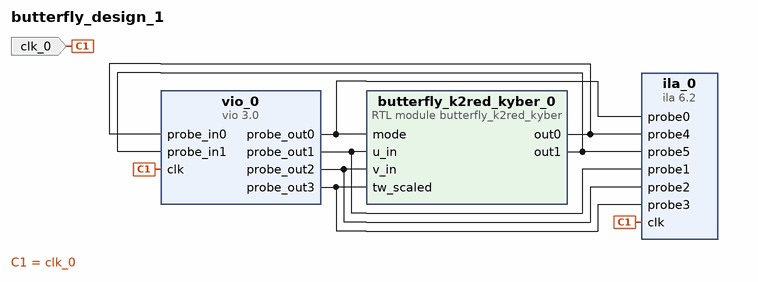
[diagram p0: block diagram of the top level]
# Vivado block design butterfly_design_1, xc7k70tfbv676-1, Vivado 2023.2
create_bd_design butterfly_design_1

create_bd_port -dir I -type clk clk_0

create_bd_cell -type module -reference butterfly_k2red_kyber butterfly_k2red_kyber_0
create_bd_cell -type ip -vlnv xilinx.com:ip:vio:3.0 vio_0
set_property -dict [list \
  CONFIG.C_NUM_PROBE_IN 2 \
  CONFIG.C_NUM_PROBE_OUT 4 \
  CONFIG.C_PROBE_OUT1_WIDTH 12 \
  CONFIG.C_PROBE_OUT2_WIDTH 12 \
  CONFIG.C_PROBE_OUT3_WIDTH 12 \
] [get_bd_cells vio_0]
create_bd_cell -type ip -vlnv xilinx.com:ip:ila:6.2 ila_0
set_property -dict [list \
  CONFIG.C_MONITOR_TYPE Native \
  CONFIG.C_NUM_OF_PROBES 6 \
  CONFIG.C_PROBE1_WIDTH 12 \
  CONFIG.C_PROBE2_WIDTH 12 \
  CONFIG.C_PROBE3_WIDTH 12 \
  CONFIG.C_PROBE4_WIDTH 12 \
  CONFIG.C_PROBE5_WIDTH 12 \
] [get_bd_cells ila_0]

# ---- connections ----

connect_bd_net [get_bd_pins butterfly_k2red_kyber_0/out0] [get_bd_pins vio_0/probe_in0] [get_bd_pins ila_0/probe4]
connect_bd_net [get_bd_pins butterfly_k2red_kyber_0/out1] [get_bd_pins vio_0/probe_in1] [get_bd_pins ila_0/probe5]
connect_bd_net -net clk_0_1 [get_bd_ports clk_0] [get_bd_pins ila_0/clk] [get_bd_pins vio_0/clk]
connect_bd_net [get_bd_pins vio_0/probe_out0] [get_bd_pins butterfly_k2red_kyber_0/mode] [get_bd_pins ila_0/probe0]
connect_bd_net [get_bd_pins vio_0/probe_out1] [get_bd_pins butterfly_k2red_kyber_0/u_in] [get_bd_pins ila_0/probe1]
connect_bd_net [get_bd_pins vio_0/probe_out2] [get_bd_pins butterfly_k2red_kyber_0/v_in] [get_bd_pins ila_0/probe2]
connect_bd_net [get_bd_pins vio_0/probe_out3] [get_bd_pins butterfly_k2red_kyber_0/tw_scaled] [get_bd_pins ila_0/probe3]

validate_bd_design
save_bd_design
